# Altium schematic sheet ATmega328P design.SchDoc
size A; SheetNumber: 1; SheetTotal: 1
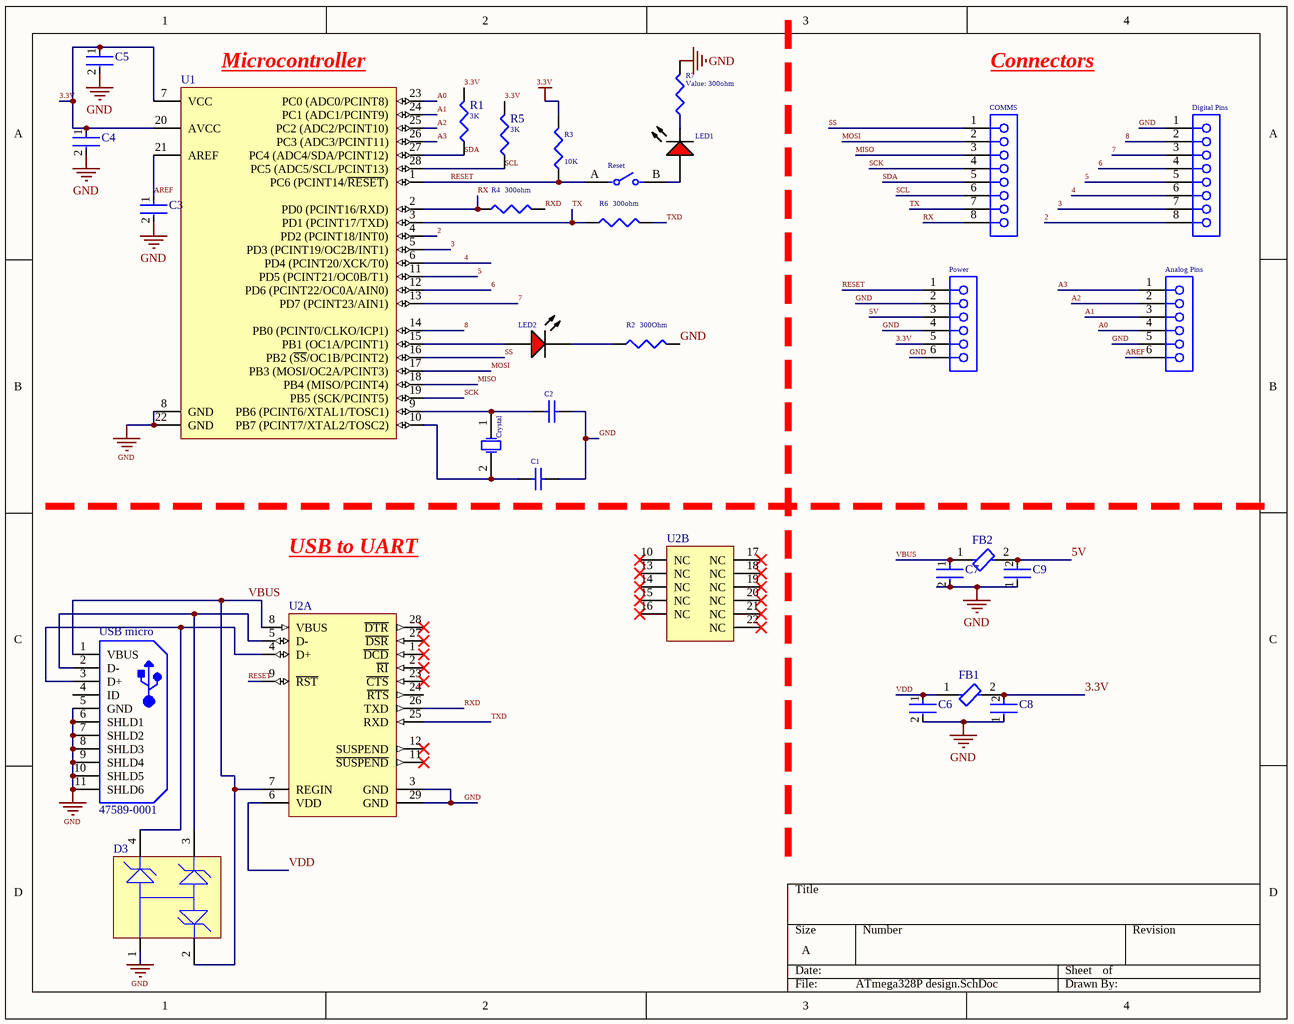
[diagram p0: ATmega328P design.SchDoc]

## Parts
Analog_Pins  SSW-106-02-G-S  [SMTC-SSW-106-02-X-S]  (value not drawn)
C1  22pF  [CAPC1608X90X35LL15T15]  (value not drawn)
C2  22pf  [CAPC1608X90X35LL15T15]  (value not drawn)
C3  GRM188R60J106ME47D  [FP-GRM188-0_1-e0_2_0_55-IPC_A]  (value not drawn)
C4  GRM188R61A226ME15D  [FP-GRM188-0_2-IPC_C]  (value not drawn)
C5  GRM188R61A226ME15D  [FP-GRM188-0_2-IPC_C]  (value not drawn)
C6  GRM188R6YA106MA73D  [FP-GRM188-0_2-IPC_C]  (value not drawn)
C7  GRM188R6YA106MA73D  [FP-GRM188-0_2-IPC_C]  (value not drawn)
C8  GRM188R60J105KA01D  [FP-GRM188-0_1-MFG]  (value not drawn)
C9  GRM188R60J105KA01D  [FP-GRM188-0_1-MFG]  (value not drawn)
COMMS  SSQ-108-01-F-S  [SMTC-SSQ-108-01-X-S]  (value not drawn)
Crystal  FOXSDLF/160-20  [FOX-FOXSDLF160-20_V]  (value not drawn)
D3  SP0503BAHTG  [LFUS-SOT143-4_V]  (value not drawn)
Digital_Pins  SSQ-108-01-F-S  [SMTC-SSQ-108-01-X-S]  (value not drawn)
FB1  BLM18PG181SN1D  [FP-BLM18-0_15-t0_8-IPC_B]  (value not drawn)
FB2  BLM18PG181SN1D  [FP-BLM18-0_15-t0_8-IPC_B]  (value not drawn)
LED1  TLMS1100-GS08  [VISH-TLMX1100_V]  (value not drawn)
LED2  TLMS1100-GS08  [VISH-TLMX1100_V]  (value not drawn)
Power  SSW-106-02-G-S  [SMTC-SSW-106-02-X-S]  (value not drawn)
R1  value 3K  [J1-0603]  (hidden comment: Res3)
R2  value 300Ohm  [J1-0603]
R3  value 10K  [J1-0603]  (hidden comment: 0603)
R4  value 300ohm  [J1-0603]  (hidden comment: Res3)
R5  value 3K  [J1-0603]  (hidden comment: Res3)
R6  value 300ohm  [J1-0603]  (hidden comment: Res3)
R7  value 300ohm  [J1-0603]
Reset  EVQ-21405R  [FP-EVQ-21405R-MFG]  (value not drawn)
U1  ATmega328P-PU  [28P3]  (value not drawn)
U2  CP2102-GM  [SLAB-QFN-28-3125x3125TP_N]  (value not drawn)  (parts A,B of 2)
USB_micro  47589-0001  [MOLX-47589-0001_V]

## Nets
3.3V: C4.1 C5.1 C8.2 FB1.2 Power.5 R1.2 R3.2 R5.2 U1.7(VCC) U1.20(AVCC)
GND: Analog_Pins.5 C1.1 C2.1 C3.2 C4.2 C5.2 C6.2 C7.2 C8.1 C9.1 D3.1 Digital_Pins.1 Power.2 Power.4 Power.6 R2.2 R7.2 U1.8(GND) U1.22(GND) U2.3(GND) U2.29(GND) USB_micro.5(GND) USB_micro.6(SHLD1) USB_micro.7(SHLD2) USB_micro.8(SHLD3) USB_micro.9(SHLD4) USB_micro.10(SHLD5) USB_micro.11(SHLD6)
2: Digital_Pins.8 U1.4(PD2_(PCINT18/INT0))
3: Digital_Pins.7 U1.5(PD3_(PCINT19/OC2B/INT1))
4: Digital_Pins.6 U1.6(PD4_(PCINT20/XCK/T0))
5: Digital_Pins.5 U1.11(PD5_(PCINT21/OC0B/T1))
5V: C9.2 FB2.2 Power.3
6: Digital_Pins.4 U1.12(PD6_(PCINT22/OC0A/AIN0))
7: Digital_Pins.3 U1.13(PD7_(PCINT23/AIN1))
8: Digital_Pins.2 U1.14(PB0_(PCINT0/CLKO/ICP1))
A0: Analog_Pins.4 U1.23(PC0_(ADC0/PCINT8))
A1: Analog_Pins.3 U1.24(PC1_(ADC1/PCINT9))
A2: Analog_Pins.2 U1.25(PC2_(ADC2/PCINT10))
A3: Analog_Pins.1 U1.26(PC3_(ADC3/PCINT11))
AREF: Analog_Pins.6 C3.1 U1.21(AREF)
MISO: COMMS.3 U1.18(PB4_(MISO/PCINT4))
MOSI: COMMS.2 U1.17(PB3_(MOSI/OC2A/PCINT3))
RESET: Power.1 R3.1 Reset.A U1.1(PC6_(PCINT14/~{RESET})) U2.9(~{RST})
RX: COMMS.8 R4.1 U1.2(PD0_(PCINT16/RXD))
RXD: R4.2 U2.26(TXD)
SCK: COMMS.4 U1.19(PB5_(SCK/PCINT5))
SCL: COMMS.6 R5.1 U1.28(PC5_(ADC5/SCL/PCINT13))
SDA: COMMS.5 R1.1 U1.27(PC4_(ADC4/SDA/PCINT12))
SS: COMMS.1 U1.16(PB2_(~{SS}/OC1B/PCINT2))
TX: COMMS.7 R6.1 U1.3(PD1_(PCINT17/TXD))
TXD: R6.2 U2.25(RXD)
VBUS: C7.1 D3.2 FB2.1 U2.7(REGIN) U2.8(VBUS) USB_micro.1(VBUS)
VDD: C6.1 FB1.1 U2.6(VDD)
NetC1_2: C1.2 Crystal.2(X2) U1.10(PB7_(PCINT7/XTAL2/TOSC2))
NetC2_2: C2.2 Crystal.1(X1) U1.9(PB6_(PCINT6/XTAL1/TOSC1))
NetD3_3: D3.3 U2.5(D-) USB_micro.2(D-)
NetD3_4: D3.4 U2.4(D+) USB_micro.3(D+)
NetLED1_1: LED1.1(A) Reset.B
NetLED1_2: LED1.2(K) R7.1
NetLED2_1: LED2.1(A) U1.15(PB1_(OC1A/PCINT1))
NetLED2_2: LED2.2(K) R2.1

Not connected (* = marked no-connect by the designer): U2 1(~{DCD})* 2(~{RI})* 10(NC)* 11(~{SUSPEND})* 12(SUSPEND)* 13(NC)* 14(NC)* 15(NC)* 16(NC)* 17(NC)* 18(NC)* 19(NC)* 20(NC)* 21(NC)* 22(NC)* 23(~{CTS})* 24(~{RTS}) 27(~{DSR})* 28(~{DTR})*; USB_micro 4(ID)

## Notes on the sheet
- (near U1) Microcontroller
- Connectors
- USB to UART

## Library data of the parts
Analog_Pins Power = CMP-1023-00359-1: SQ Post Socket, Through-hole, Vertical, -55 to 125 degC, 2.54mm Pitch, 6-Pin, Female, RoHS; Manufacturer: Samtec; ComponentLink1Description: Manufacturer URL; Pitch: 2.54 mm; ComponentLink1URL: http://www.samtec.com; ComponentLink2Description: Datasheet; PackageVersion: CA, 6/1987; Orientation: Vertical; RoHS: True; PackageReference: SSW-106-02-X-S; ComponentLink2URL: http://www.samtec.com/documents/webfiles/pdf/SSW_TH.PDF; Mounting Technology: Through-hole; Temperature Range: -55 to 125 degC; PackageDescription: Assembly, Socket Strip .016 X .031 Tail; DatasheetVersion: F-214; ComponentLink3Description: Package Specification; PartNumber: SSW-106-02-G-S; ComponentLink3URL: http://www.samtec.com/documents/webfiles/cpdf/SSW-1XX-XX-XXX-X-XX-XXX-XX-MKT.pdf
C1 C2 = CMP-2006-04016-1: Manufacturer: AVX Interconnect / Elco; Part Number: 06031A220KAT2A
C3 = CMP-2006-02792-2: Chip Multilayer Ceramic Capacitors for General Purpose, 0603, 0.1uF, X5R, 15%, 20%, 6.3V; Capacitance: 10uF; Packaging: Tape and Reel; Voltage Rating (DC): 6.3V; Width: 0.031inch; Termination: SMD/SMT; Dielectric: X5R; Package Quantity: 4000; Voltage Rating: 6.3V; Case/Package: 0603; Min Operating Temperature: -55°C; Voltage: 6.3V; Length: 1.6mm; Thickness: 0.035inch; Lead Free: Lead Free; Depth: 0.8mm; Case Code (Imperial): 0603; Max Operating Temperature: 85°C; Material: Ceramic; Height: 0.8mm; Tolerance: 20%; Mount: Surface Mount; REACH SVHC: No SVHC; Radiation Hardening: No; Case Code (Metric): 1608
C4 C5 = CMP-2000-06337-3: Chip Multilayer Ceramic Capacitors for General Purpose, 0603, 22uF, X5R, 15%, 20%, 10V; Tolerance: 20%; Weight: 0.000222oz; Material: Ceramic; Depth: 0.8mm; Length: 1.6mm; Termination: SMD/SMT; Capacitance: 22uF; Packaging: Tape and Reel; Width: 0.8mm; Voltage Rating: 10V; Case Code (Imperial): 0603; Mount: Surface Mount; Voltage Rating (DC): 10V; Case/Package: 0603; Thickness: 0.039inch; REACH SVHC: No SVHC; Dielectric: X5R; Height: 0.8mm; Package Quantity: 4000; Case Code (Metric): 1608; Min Operating Temperature: -55°C; Lead Free: Lead Free; Max Operating Temperature: 85°C
C6 C7 = CMP-06035-045466-1: Chip Multilayer Ceramic Capacitors for General Purpose, 0603, 10uF, X5R, 15%, 20%, 35V; Case Code (Imperial): 0603; Voltage Rating (DC): 35V; Width: 0.031inch; Dielectric: X5R; Voltage Rating: 35V; Min Operating Temperature: -55°C; Thickness: 0.039inch; Mount: Surface Mount; Case/Package: 0603; Length: 0.063inch; Capacitance: 10uF; Max Operating Temperature: 85°C; Packaging: Tape and Reel; Tolerance: 20%; Case Code (Metric): 1608
C8 C9 = CMP-2006-02790-2: CAP CER 1UF 6.3V X5R 0603; Insulation Resistance: 500MR; Tolerance: 10%; Dielectric Material: Ceramic; Thickness: 0.035inch; Depth: 0.8mm; Min Operating Temperature: -55°C; Mount: Surface Mount; Voltage Rating (DC): 6.3V; Case/Package: 0603; Capacitance: 1uF; Voltage Rating: 6.3V; Voltage: 6.3V; Max Operating Temperature: 85°C; Case Code (Imperial): 0603; Dielectric: X5R; Packaging: Tape and Reel; Height: 0.8mm; Case Code (Metric): 1608; Radiation Hardening: No; REACH SVHC: No SVHC; Width: 0.031inch; Package Quantity: 1; Lead Free: Lead Free; Length: 1.6mm; Termination: SMD/SMT
COMMS Digital_Pins = CMP-1023-00294-1: SQ Post Socket, Through-hole, Vertical, -55 to 125 degC, 2.54 mm Pitch, 8-Pin, Female, RoHS; Manufacturer: Samtec; Pitch: 2.54 mm; ComponentLink3URL: http://www.samtec.com/documents/webfiles/cpdf/SSQ-1XX-XX-XXX-X-XX-XXX-XX-X-MKT.pdf; ComponentLink2URL: http://www.samtec.com/documents/webfiles/pdf/SSQ_TH.PDF; Mounting Technology: Through-hole; PackageReference: SSQ-108-01-X-S; Orientation: Vertical; PackageDescription: Assembly, Socket Strip .025[0.64] SQ Tail; ComponentLink2Description: Datasheet; PartNumber: SSQ-108-01-F-S; Temperature Range: -55 to 125 degC; ComponentLink1URL: http://www.samtec.com; ComponentLink3Description: Package Specification; PackageVersion: BD, 6/1987; RoHS: True; ComponentLink1Description: Manufacturer URL; DatasheetVersion: F-214
Crystal = CMP-1749-00001-1: Resistance Weld SMD Crystal, 16 MHz, +/- 30 ppm, 20 pF, -20 to 70 degC, 2-Pin SMD, RoHS, Tape and Reel; Output Current: 3 mA; Case\Package: SOT-553-6; Min Supply Voltage (DC): 4 V; Max Supply Voltage: 3.3 V; Min Supply Voltage: 1.4 V; Interface: I2C; Max Supply Voltage (DC): 6 V; ComponentLink2Description: Datasheet; REACH SVHC: No SVHC; ComponentLink1URL: http://www.foxonline.com/; ComponentLink2URL: http://foxonline.com/pdfs/hc49sdlf.pdf; Pins: 6; Packaging: Cut Tape; ComponentLink1Description: Manufacturer URL; Weight: 9.9E-05 oz; Length: 1.6 mm; RoHSCompliant: true; Min Operating Temperature: -55 degC; Radiation Hardening: No; PackageDescription: 2-Pin Surface Mount Device, Body 5 x 11.7 mm, Height 4.5 mm; Package Quantity: 1; Width: 1.2 mm; DatasheetVersion: Mar-15; Max Operating Temperature: 150 degC; Mount: Surface Mount; PackageReference: FOX-FOXSDLF160-20; Height: 0.55 mm
D3 = CMP-2000-05191-1: TVS Diode Array, 30 pF, 30 KV, -40 to 85 degC, 4-Pin SOT143, RoHS, Tape and Reel; Manufacturer: Littelfuse; Direction Type: Uni-Directional; Product Height (mm): 1.05mm; Leakage Current (Max): 0.1uA; Clamping Voltage (Max): 8V; Reverse Stand-off Voltage: 5.5(Min)V; Configuration: Triple; Working Voltage: 5.5V; Product Length (mm): 3.04mm; Working Voltage (Max): 5.5V(Min); Capacitance Value: 30pF; Rad Hardened: No; Number of Elements: 3; Product Depth (mm): 1.4mm; Operating Temperature Max Deg. C: 85C; Suppressor Type: TVS; Operating Temperature Min Deg. C: -40C; Operating Temp Range: -40Cto85C; Mounting: SurfaceMount; Package / Case: SOT-143; Datasheet Version: Dec-13; Package Type: SOT-143; Packaging: TapeandReel; Pin Count: 3+Tab; Operating Temperature Classification: Industrial; Datasheet URL: https://datasheet.ciiva.com/15143/getdatasheetpartid-116020-15143550.pdf; Manufacturer URL: http://www.littelfuse.com/; Leakage Current: 0.1uA; Mounting Style: SurfaceMount; Clamping Voltage: 8V; Polarity: Uni-Directional
FB1 FB2 = CMP-0686-00566-4: Chip Ferrite Bead, 0603, 180Ω @ 100MHz, 0.09Ω, 25%, 1.5A; Number of Lines: 1; DC Resistance (DCR): 90mR; Shielding: Unshielded; Impedance: 180R; Depth: 0.8mm; Packaging: Tape and Reel; Width: 0.8mm; Current Rating: 1.5A; Min Operating Temperature: -55°C; Case Code (Metric): 1608; Case/Package: 0603; Max DC Current: 1.5A; Tolerance: 25%; Package Quantity: 1; Core Material: Ferrite; Number of Circuits: 1; Radiation Hardening: No; Height: 0.8mm; Max Operating Temperature: 125°C; Length: 1.6mm; Lead Free: Lead Free; REACH SVHC: No SVHC; Case Code (Imperial): 0603; Material: Ferrite; Max Current Rating: 1.5A; Termination: SMD/SMT; Number of Pins: 2; DC Current: 1.5A; Test Frequency: 100MHz
LED1 LED2 = CMP-1666-00027-1: LED, RED, 2.1 V, -40 to 100 degC, 2-Pin SMD (0603), RoHS, Tape and Reel; Type (Capacitors): C0G; Resistance: 100000000000 Ohm; Capacitance: 12 pF; Voltage Rating: 50 V; Tolerance: 5%; Min Operating Temperature: -55degC; REACH SVHC: No SVHC; ComponentLink2Description: Datasheet; ComponentLink1URL: http://www.vishay.com/; Width: 0.8 mm; Package Quantity: 4000; PackageReference: TLMX1100; ComponentLink2URL: http://www.vishay.com/docs/83173/tlmb1100.pdf; Case/Package: 0603; Case Code (Metric): 1608; Packaging: Tape and Reel; Pins: 2; ComponentLink1Description: Manufacturer URL; Max Operating Temperature: 125degC; Height: 0.8 mm; Length: 1.6 mm; Mount: Surface Mount; PackageDescription: 2-Pin Surface Mount Device, Body 1.6 x 0.8 mm; DatasheetVersion: Rev. 2.7, 03/2016; Case Code (Imperial): 0603; Voltage Rating (DC): 50 V; RoHSCompliant: True; Radiation Hardening: No
R1-R7 = Res3: Resistor; Published: 8-Jun-2000; LatestRevisionDate: 29-May-2009; LatestRevisionNote: IPC-7351 Footprint Added.; PackageReference: J1-0603; Publisher: Altium Limited; PackageDescription: Chip Resistor
Reset = CMP-00287-55650591-1: EVQ-21405R Switch Tactile N.O. SPST Round Button PC Pins 0.02A 15VDC 1.3N Thru-Hole Radial T/R; Contact Current Rating: 20mA; Voltage Rating (DC): 15V; Actuator Length: 1.6mm; Life (Cycles): 100kcycles; Switch Travel: 250µm; Number of Positions: 2; Contact Resistance: 50mΩ; Illumination Type: Illuminated, Non-Illuminated; Switch Function: Off-Mom; Operating Force: 1.3N; Lead Free: Lead Free; Current Rating: 20mA; NexarPartId: 55650591; Min Operating Temperature: -20°C; Depth: 6mm; Width: 6mm; Radiation Hardening: No; Orientation: Straight; Throw Configuration: SPST; Case/Package: Radial; Termination: PC Pin; Max Current Rating: 20mA; Max Voltage Rating (DC): 15V; Electrical Life: 100kcycles; Contact Plating: Silver; REACH SVHC: Unknown; Max Operating Temperature: 70°C; Weight: 1.451496g; Mount: Through Hole; RoHS: Compliant; Mechanical Life: 100kcycles; Height: 5mm; Length: 6mm
U1 = CMP-0095-00013-2: 8-bit AVR Microcontroller, 32KB Flash, 1KB EEPROM, 2KB SRAM, 28-pin PDIP, Industrial Grade (-40°C to 85°C); RevisionNote: DatasheetVersion updated. URLs added.; PackageVersion: revB, Sep-2001; PackageDescription: 28-lead (0.300"/7.62mm Wide) Plastic Dual Inline Package (PDIP); DatasheetVersion: revD, May-2011; ComponentLink1Description: Manufacturer URL; ComponentLink1URL: http://www.atmel.com/; PackageReference: 28P3; ComponentLink2Description: ATmega48A/48PA/88A/88PA/168A/168PA/328/328P Datasheet; ComponentLink3URL: http://www.atmel.com/dyn/resources/prod_documents/8271S.pdf; ComponentLink2URL: http://www.atmel.com/dyn/resources/prod_documents/8271.pdf; ComponentLink3Description: ATmega48A/48PA/88A/88PA/168A/168PA/328/328P Summary
U2 = CMP-0511-00012-1: Single-Chip USB to UART Bridge, 1024 Bytes EEPROM, -40 to 85 degC, 28-pin QFN, Tube; Manufacturer: Silicon Labs; Internal Oscillator: TRUE; Sub-Family: USB Bridges; ComponentLink3Description: Package Specification; PackageDescription: 28-Pin Quad-Flat No-Leads Package, Body 5 x 5 mm, Pitch 0.5 mm; PartNumber: CP2102-GM; EEPROM: 1024 Bytes; Mounting Technology: Surface Mount; ComponentLink2URL: http://www.silabs.com/Support%20Documents/TechnicalDocs/CP2102-9.pdf; DatasheetVersion: Rev. 1.5; ComponentLink1URL: http://www.silabs.com/; ComponentLink2Description: Datasheet; Code_JEDEC: MO-220; PackageReference: QFN-28; Code_IPC: J-STD-020C; ComponentLink3URL: http://www.silabs.com/Support%20Documents/TechnicalDocs/C8051T61x.pdf; ComponentLink1Description: Manufacturer URL
USB_micro = CMP-2000-05610-1: Right Angle Female Type AB Micro USB Connector, 30 V, 1.8 A, -30 to 85 degC, RoHS, Tape and Reel; Number of Ports: 1Port; Current Rating: 1.8A; Brand: Molex; Connector Type: MicroUSBTypeABreceptacle; Number of Contacts: 5Contact; Voltage Rating: 30VAC; Color: Black; Product: MicroUSBTypeABConnectors; Package URL: http://www.molex.com/pdm_docs/sd/475890001_sd.pdf; Contact Plating: Gold; Datasheet URL: http://www.molex.com/webdocs/datasheets/pdf/en-us/0475890001_IO_CONNECTORS.pdf; Operating Temperature Range: -20Cto+85C; Termination Style: SMD/SMT; Mounting Angle: Right; Package Reference: 47589-0001; Gender: Female; Package Description: Micro USB Connector, Pitch 0.65 mm, 5 Positions, Body 7.5 x 5.6 mm; Mounting Technology: SurfaceMount; Contact Material: CopperAlloy; Packaging: Reel; RoHS: True; Standard: USB; Manufacturer URL: http://www.molex.com/; Manufacturer: Molex; Datasheet Version: 12/2016; Product Category: USBConnectors; Series: 47589